# EAGLE schematic asdr (EAGLE 6.5.0)
CV Gate Triggered ASDR Adapted from: http://www.uni-bonn.de/~uzs159
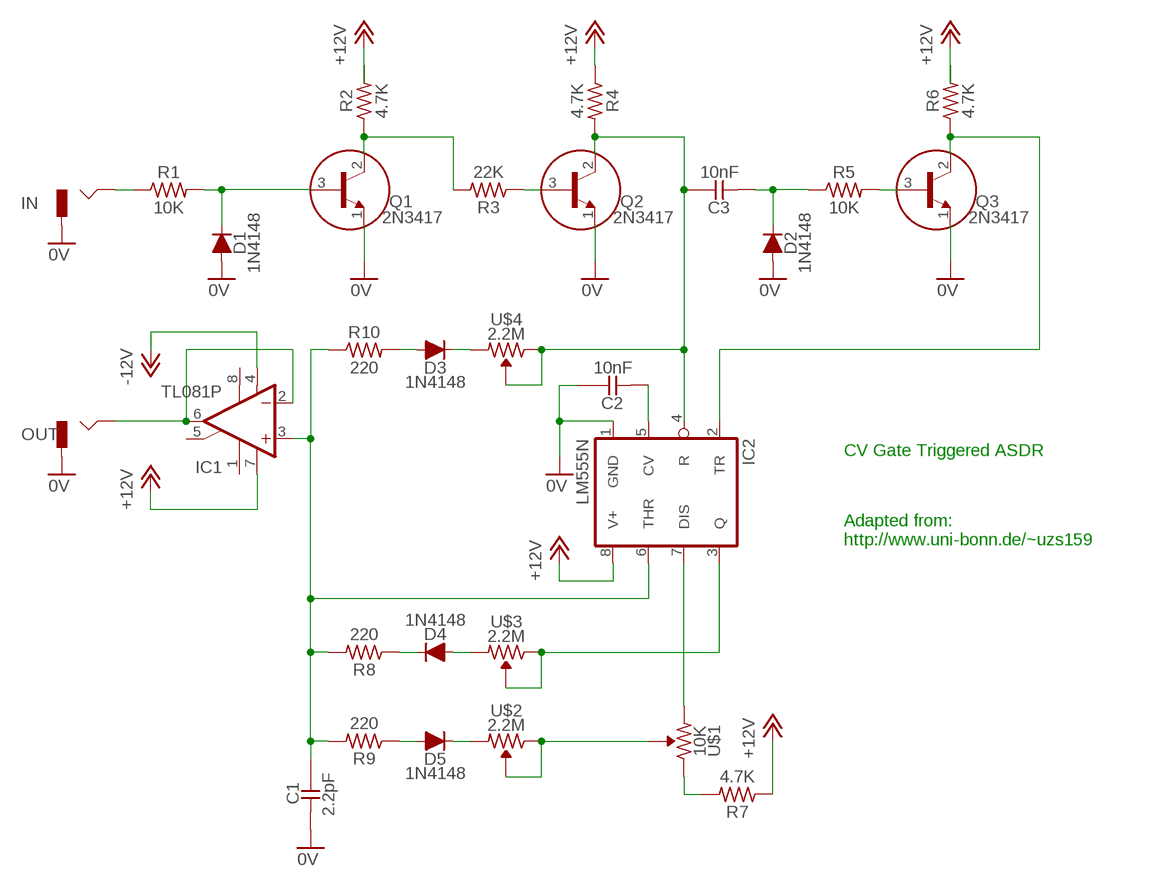
[diagram p0: schematic, sheet 1]

## Parts
C1  2.2pF  CC-US025-024X044  [C025-024X044]
C2  10nF  CC-US025-024X044  [C025-024X044]
C3  10nF  CC-US025-024X044  [C025-024X044]
D1  1N4148  [DO35-7]
D2  1N4148  [DO35-7]
D3  1N4148  [DO35-7]
D4  1N4148  [DO35-7]
D5  1N4148  [DO35-7]
IC1  TL081P  [DIL08]
IC2  LM555N  [DIL08]
IN  JACK-M  [JACK-M]
OUT  JACK-M  [JACK-M]
Q1  2N3417  [TO92]
Q2  2N3417  [TO92]
Q3  2N3417  [TO92]
R1  10K  R0309/10  [0309/10]
R2  4.7K  R0309/10  [0309/10]
R3  22K  R0309/10  [0309/10]
R4  4.7K  R0309/10  [0309/10]
R5  10K  R0309/10  [0309/10]
R6  4.7K  R0309/10  [0309/10]
R7  4.7K  R0309/10  [0309/10]
R8  220  R0309/10  [0309/10]
R9  220  R0309/10  [0309/10]
R10  220  R0309/10  [0309/10]
U$1  10K  R-VAR  [R-VAR]
U$2  2.2M  R-VAR  [R-VAR]
U$3  2.2M  R-VAR  [R-VAR]
U$4  2.2M  R-VAR  [R-VAR]

## Nets
0V: C1.2 C2.1 D1.A D2.A IC2.1(GND) IN.GND OUT.GND Q1.1(E) Q2.1(E) Q3.1(E)
+12V: IC1.7(V+) IC2.8(V+) R4.1 R7.1
-12V: IC1.4(V-)
N$1: IN.HOT R1.1
N$2: D1.C Q1.3(B) R1.2
N$3: Q1.2(C) R2.1 R3.2
N$4: Q2.3(B) R3.1
N$5: C3.1 IC2.4(R) Q2.2(C) R4.2 U$4.R1 U$4.VAR
N$6: C3.2 D2.C R5.1
N$7: Q3.3(B) R5.2
N$8: IC2.2(TR) Q3.2(C) R6.1
N$9: D3.C U$4.R2
N$10: D3.A R10.2
N$11: C1.1 IC1.3(+IN) IC2.6(THR) R8.2 R9.2 R10.1
N$12: D4.C R8.1
N$13: D4.A U$3.R2
N$14: D5.A R9.1
N$15: D5.C U$2.R2
N$16: U$1.VAR U$2.R1 U$2.VAR
N$17: IC2.3(Q) U$3.R1 U$3.VAR
N$18: IC2.7(DIS) U$1.R2
N$19: R7.2 U$1.R1
N$20: C2.2 IC2.5(CV)
N$22: IC1.2(-IN) IC1.6(OUT) OUT.HOT
Unconnected: IC1.1(ON1) IC1.5(ON2) IC1.8(OPT) R2.2 R6.2

## Notes on the sheet
- CV Gate Triggered ASDR
- Adapted from:
  http://www.uni-bonn.de/~uzs159

## Library data of the parts
C1-C3 = _common:CC-US: CAPACITOR, US symbol
D1-D5 = _common:1N4148: DIODE high speed (Philips)
IC1 = linear:TL081: OP AMP
IC2 = linear:*555: TIMER
IN OUT = _common:JACK-M
Q1-Q3 = _common:2N3417: NPN Transistor
R1-R10 = _common:R: RESISTOR, US symbol
U$1-U$4 = _common:R-VAR